# Altium schematic sheet Lesegerät_RC-Ozillator.SchDoc
size A4; SheetNumber: 2; SheetTotal: 4
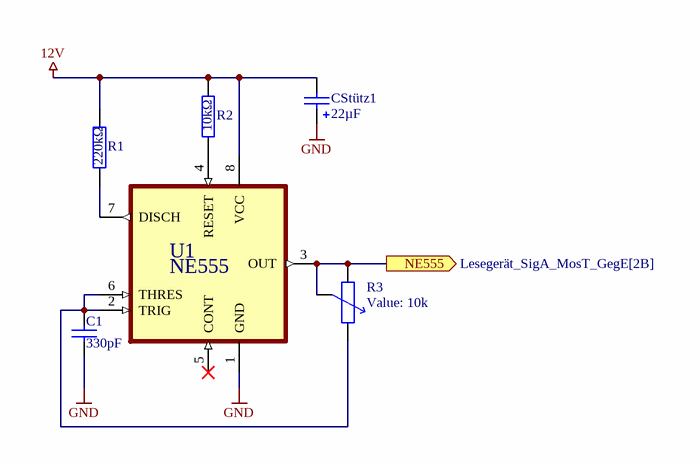
[diagram p0: Lesegerät_RC-Ozillator.SchDoc]

## Parts
C1  330pF  [rad-7.2/2.5/5]
CStütz1  value 22µF  [RB-.1/.2]  (hidden comment: ELKO)
R1  value 220kΩ  [Axial-0.4]  (hidden comment: RES)
R2  value 10kΩ  [Axial-0.4]  (hidden comment: RES)
R3  value 10k  [PT15]  (hidden comment: POT)
U1  NE555  [DIP794W45P254L959H508Q8]

## Ports
NE555 (out, see Lesegerät_SigA_MosT_GegE[2B])

## Nets
12V: CStütz1.2 R1.2 R2.2 U1.8(VCC)
GND: C1.2 CStütz1.1 U1.1(GND)
NE555: R3.1 R3.3 U1.3(OUT) ; port NE555
NetC1_1: C1.1 R3.2 U1.2(TRIG) U1.6(THRES)
NetR1_1: R1.1 U1.7(DISCH)
NetR2_1: R2.1 U1.4(RESET)

Not connected (* = marked no-connect by the designer): U1 5(CONT)*

## Library data of the parts
C1 = KO: Kondensator
R1 R2 = RES: Widerstand
R3 = POT: Potentiometer; Set Position: 0.5
U1 = NE555P: Single Precision Timer; MF: Texas; SnapEDA_Link: https://www.snapeda.com/parts/NE555P/Texas+Instruments/view-part/?ref=snap; Package: PDIP-8 Texas; Value: *; MP: NE555P; Check_prices: https://www.snapeda.com/parts/NE555P/Texas+Instruments/view-part/?ref=eda